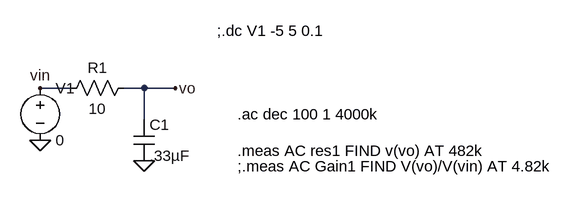
[diagram p0: schematic LAB2.3.1.asc]
LAB2.3.1.asc, the LTspice schematic file:
Version 4
SHEET 1 1160 680
WIRE 416 272 368 272
WIRE 528 272 496 272
WIRE 576 272 528 272
WIRE 528 320 528 272
FLAG 576 272 vo
FLAG 368 352 0
FLAG 528 384 0
FLAG 368 272 vin
SYMBOL res 512 256 R90
WINDOW 0 0 56 VBottom 2
WINDOW 3 32 56 VTop 2
SYMATTR InstName R1
SYMATTR Value 10
SYMBOL cap 512 320 R0
SYMATTR InstName C1
SYMATTR Value .33µF
SYMBOL voltage 368 256 R0
SYMATTR InstName V1
SYMATTR Value 0
SYMATTR Value2 AC 1
TEXT 640 184 Left 2 !;.dc V1 -5 5 0.1
TEXT 672 312 Left 2 !.ac dec 100 1 4000k
TEXT 672 368 Left 2 !.meas AC res1 FIND v(vo) AT 482k
TEXT 672 392 Left 2 !;.meas AC Gain1 FIND V(vo)/V(vin) AT 4.82k

The netlist it stands for:
* LAB2.3.1.asc
R1 vo vin 10
C1 vo 0 .33µF
V1 vin 0 0 AC 1
;.dc V1 -5 5 0.1
.ac dec 100 1 4000k
.meas AC res1 FIND v(vo) AT 482k
;.meas AC Gain1 FIND V(vo)/V(vin) AT 4.82k
.backanno
.end